# EAGLE design Addon-mapleCUx_Raspi-3V3-UART-CC2530-V03-003 (EAGLE 9.1.0)
MAPLE-CUx Large Version
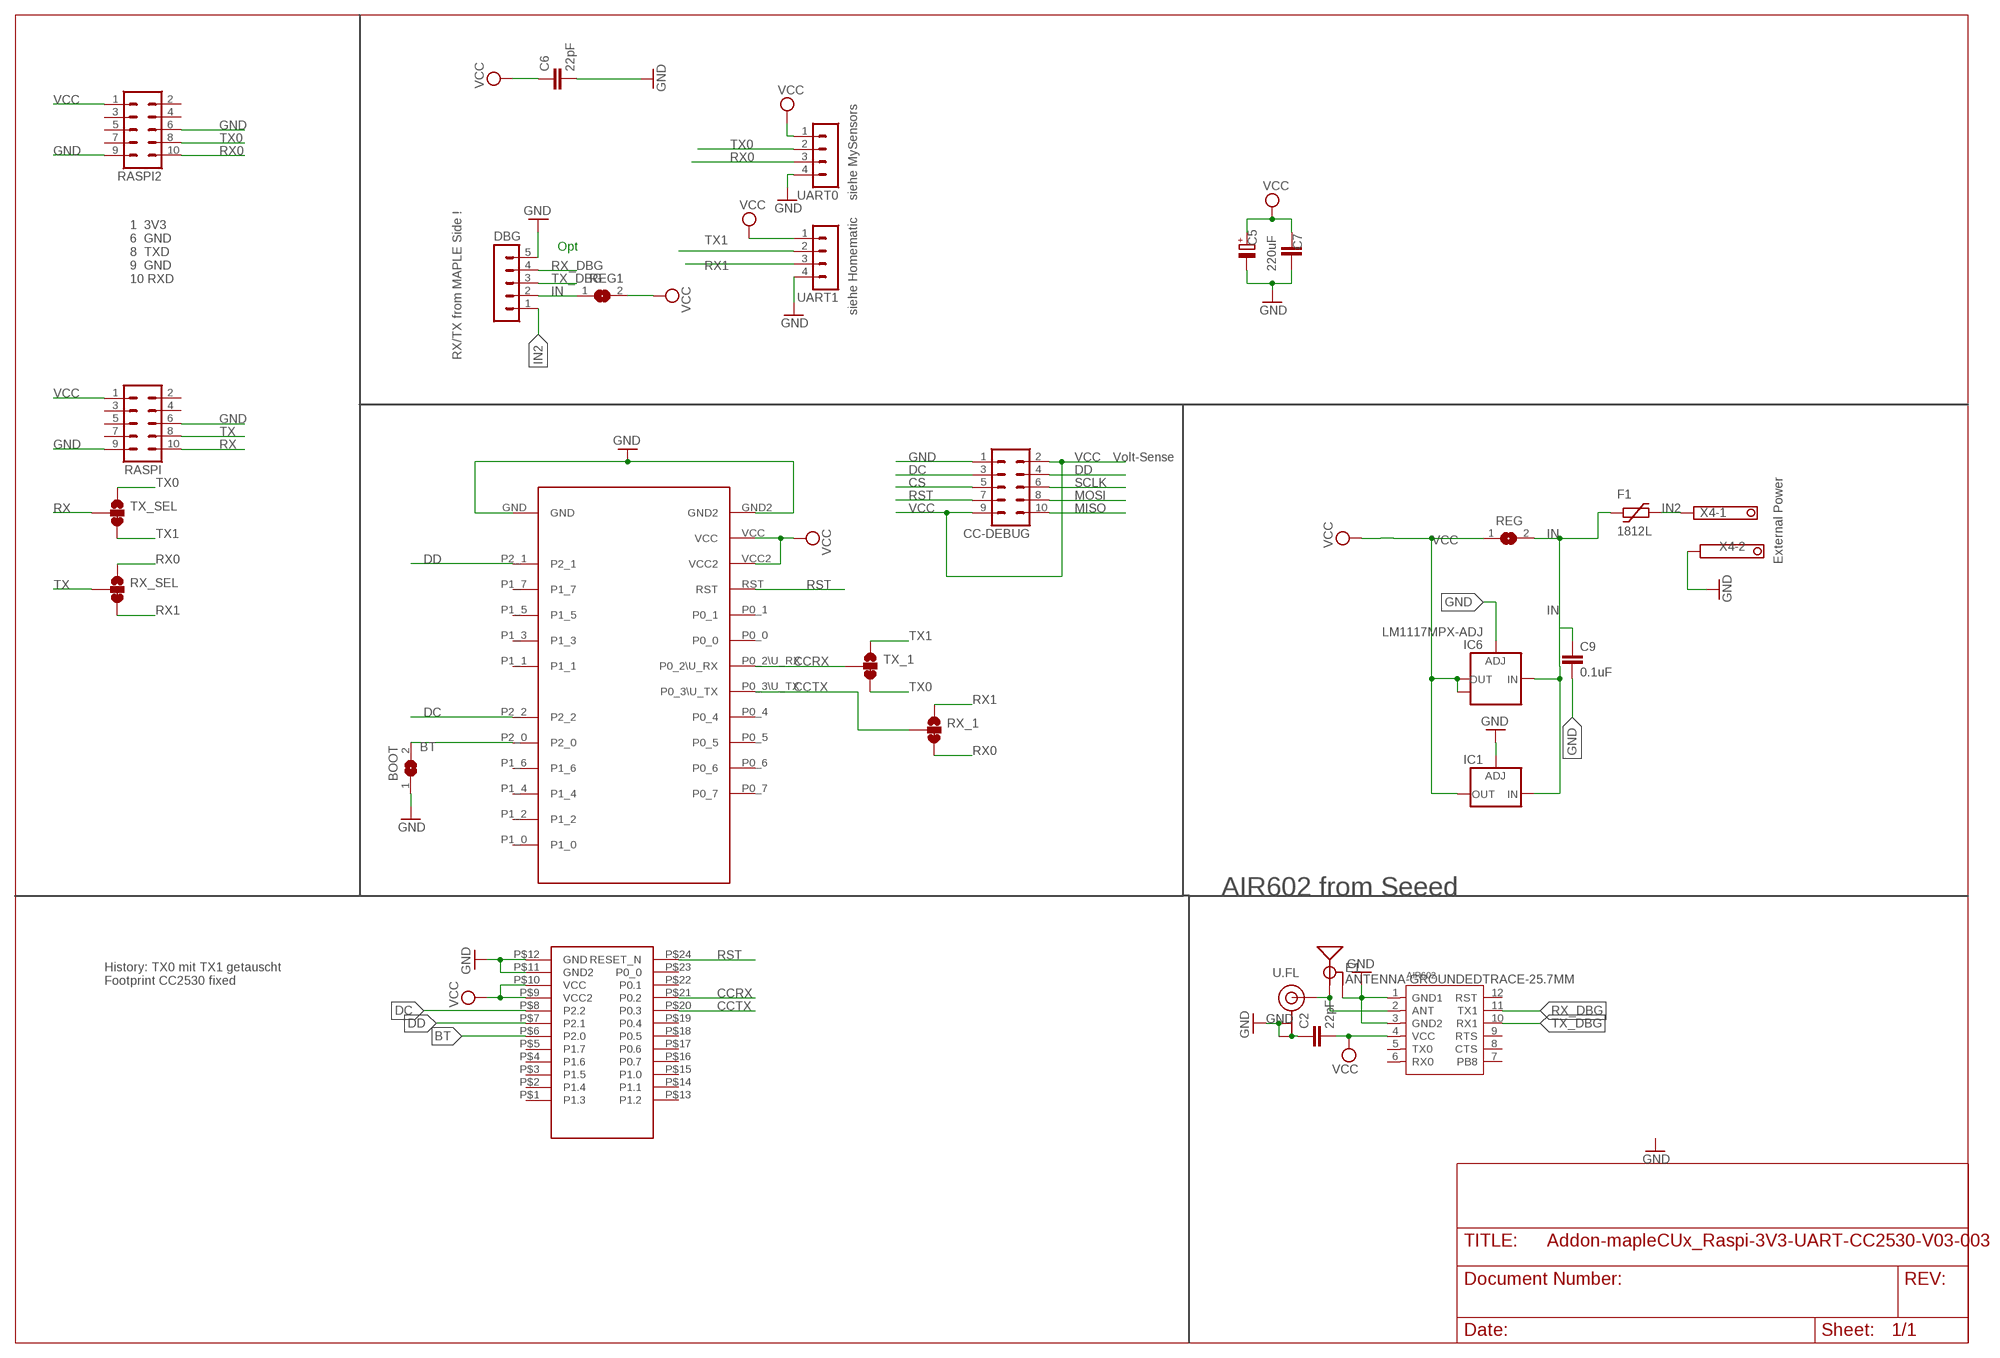
[diagram p0: schematic, sheet 1]

## Parts
AIR602  AIR602  [MODULE12P-2.0-10X12MM]
BOOT  SJ  [SJ]
C2  22pF  C-EUC0805  [C0805]
C5  220uF  CPOL-EUE5-8.5  [E5-8,5]
C6  22pF  C-EUC0805  [C0805]
C7  C-EUC1812  [C1812]
C9  0.1uF  C-EUC1206  [C1206]
CC-DEBUG  MA05-2  [MA05-2]
DBG  MA05-1  [MA05-1]
E1  ANTENNA-GROUNDEDTRACE-25.7MM  [TRACE_ANTENNA_2.4GHZ_25.7MM]
F1  1812L  [1812L]
IC1  LD117ADT50TR  [DPACK]
IC6  LM1117MPX-ADJ  [SOT223]
RASPI  MA05-2  [MA05-2]
RASPI2  MA05-2  [MA05-2]
REG  SJ  [SJ]
REG1  SJ  [SJ]
RX_1  JUMPER-SMT_3_1-NC_TRACE_SILK  [SMT-JUMPER_3_1-NC_TRACE_SILK]
RX_SEL  JUMPER-SMT_3_1-NC_TRACE_SILK  [SMT-JUMPER_3_1-NC_TRACE_SILK]
TX_1  JUMPER-SMT_3_1-NC_TRACE_SILK  [SMT-JUMPER_3_1-NC_TRACE_SILK]
TX_SEL  JUMPER-SMT_3_1-NC_TRACE_SILK  [SMT-JUMPER_3_1-NC_TRACE_SILK]
U$1  CC2530CC2530PA  [CC2530PA]
U$3  CC2530_MODULE  [CC2530_DIL]
U.FL  U.FL  [U.FL]
UART0  MA04-1  [MA04-1]
UART1  MA04-1  [MA04-1]
X4  1751248  [1751248]

## Nets
BT: BOOT.2 U$1.P$6(P2.0) U$3.P2_0
CCRX: TX_1.2 U$1.P$21(P0.2) U$3.P0_2\U_RX
CCTX: RX_1.2 U$1.P$20(P0.3) U$3.P0_3\U_TX
CS: CC-DEBUG.5
DC: CC-DEBUG.3 U$1.P$8(P2.2) U$3.P2_2
DD: CC-DEBUG.4 U$1.P$7(P2.1) U$3.P2_1
GND [PWR]: AIR602.1(GND1) AIR602.3(GND2) BOOT.1 C2.1 C5.- C6.2 C7.1 C9.2 CC-DEBUG.1 DBG.5 E1.GND E1.GND2(GND) IC1.1(ADJ) IC6.1(ADJ) RASPI2.6 RASPI2.9 RASPI.6 RASPI.9 U$1.P$11(GND2) U$1.P$12(GND) U$3.GND U$3.GND2 U.FL.1(GND) U.FL.2(GND) UART0.4 UART1.4 X4.2
IN [PWR]: C9.1 DBG.2 F1.P$1 IC1.3(IN) IC6.3(IN) REG1.1 REG.2
IN2 [PWR]: DBG.1 F1.P$2 X4.1
MISO: CC-DEBUG.10
MOSI: CC-DEBUG.8
N$4: AIR602.2(ANT) E1.ANT(SIGNAL) U.FL.FEED(SIGNAL)
RST: CC-DEBUG.7 U$1.P$24(RESET_N) U$3.RST
RX: RASPI.10 TX_SEL.2
RX0: RASPI2.10 RX_1.3 RX_SEL.1 UART0.3
RX1: RX_1.1 RX_SEL.3 UART1.3
RX_DBG: AIR602.11(TX1) DBG.4
SCLK: CC-DEBUG.6
TX: RASPI.8 RX_SEL.2
TX0: RASPI2.8 TX_1.3 TX_SEL.1 UART0.2
TX1: TX_1.1 TX_SEL.3 UART1.2
TX_DBG: AIR602.10(RX1) DBG.3
VCC [PWR]: AIR602.4(VCC) C2.2 C5.+ C6.1 C7.2 CC-DEBUG.2 CC-DEBUG.9 IC1.4(OUT) IC6.2(OUT) IC6.TAB(OUT1) RASPI2.1 RASPI.1 REG1.2 REG.1 U$1.P$9(VCC2) U$1.P$10(VCC) U$3.VCC U$3.VCC2 UART0.1 UART1.1
Unconnected: AIR602.5(TX0) AIR602.6(RX0) AIR602.7(PB8) AIR602.8(CTS) AIR602.9(RTS) AIR602.12(RST) RASPI2.2 RASPI2.3 RASPI2.4 RASPI2.5 RASPI2.7 RASPI.2 RASPI.3 RASPI.4 RASPI.5 RASPI.7 U$1.P$1(P1.3) U$1.P$2(P1.4) U$1.P$3(P1.5) U$1.P$4(P1.6) U$1.P$5(P1.7) U$1.P$13(P1.2) U$1.P$14(P1.1) U$1.P$15(P1.0) U$1.P$16(P0.7) U$1.P$17(P0.6) U$1.P$18(P0.5) U$1.P$19(P0.4) U$1.P$22(P0.1) U$1.P$23(P0_0) U$3.P0_0 U$3.P0_1 U$3.P0_4 U$3.P0_5 U$3.P0_6 U$3.P0_7 U$3.P1_0 U$3.P1_1 U$3.P1_2 U$3.P1_3 U$3.P1_4 U$3.P1_5 U$3.P1_6 U$3.P1_7

## Notes on the sheet
- siehe MySensors
- Opt
- 1  3V3
  6  GND
  8  TXD
  9  GND
  10 RXD
- siehe Homematic
- RX/TX from MAPLE Side !
- Volt-Sense
- External Power
- AIR602 from Seeed
- History: TX0 mit TX1 getauscht
  Footprint CC2530 fixed

## Library data of the parts
AIR602 = AIR602:AIR602
BOOT REG REG1 = jumper:SJ: SMD solder JUMPER
C2 = rcl:C-EU: CAPACITOR, European symbol
C5 = rcl:CPOL-EU: POLARIZED CAPACITOR, European symbol; SPICEPREFIX: C
C6 C7 C9 = rcl:C-EU: CAPACITOR, European symbol; SPICEPREFIX: C
CC-DEBUG RASPI RASPI2 = con-lstb:MA05-2: PIN HEADER; OC_FARNELL: unknown; OC_NEWARK: unknown
DBG = con-lstb:MA05-1: PIN HEADER; OC_FARNELL: unknown; OC_NEWARK: unknown
E1 = SparkFun-RF:ANTENNA-GROUNDED: Antenna w/ Ground Connection 2.4GHz antennae with signal and ground terminals. TRACE_ANTENNA_2.4GHZ_15.2MM - Meander Trace antenna 15.2 x 5.7mm footprint Based on layout from TI app note AN043 <http://www.ti.com/lit/an/swra117d/swra117d.pdf>. TRACE_ANTENNA_2.4GHZ_25.7MM - Inverted F trace antenna 25.7 x 7.5 mm footprint. Based on layout from TI design note DN0007 <http://www.ti.com/lit/an/swru120b/swru120b.pdf>.
F1 = ptc-littlefuse:1812L
IC1 = v-reg:LD117A?*: Low drop fixed and adjustable positive voltage regulators 1 A Source: http://www.st.com/stonline/products/literature/ds/7194/ld1117axx.pdf
IC6 = lm1117:LM1117MPX-ADJ
RX_1 RX_SEL TX_1 TX_SEL = SparkFun-Jumpers:JUMPER-SMT_3_1-NC_TRACE: Normally closed trace jumper (1 of 2 connections) This jumper has a trace between two pads so it's normally closed (NC). The other connection is normally open (NO). Use a razor knife to open the connection. For best results follow the IPC guidelines for cutting traces: Cutout at least 0.063 mm (0.005 in). Remove all loose material to clean up the cut area. Seal the cut with an approved epoxy. Reapply solder to reclose the connection, or to close the NO connection.
U$1 = zigbee:CC2530: CC2530 Wireless Zigbee Module 3.0-3.6V 2.405-2.485GHz
U$3 = Martin-Communication-V4:CC2530_MODULE
U.FL = SparkFun-Connectors:U.FL: SMD Antenna Connector - U.FL 2mm height, 3.0mm x 3.0mm receptacle size. SparkFun Products: SparkFun WiFi Shield - ESP8266 <https://www.sparkfun.com/products/13287> SparkFun ESP8266 Thing <https://www.sparkfun.com/products/13231> SparkFun MiniGen - Pro Mini Signal Generator Shield <https://www.sparkfun.com/products/11420>; PROD_ID: CONN-09193; SF_ID: WRL-09144
UART0 UART1 = con-lstb:MA04-1: PIN HEADER; OC_FARNELL: unknown; OC_NEWARK: unknown
X4 = con-phoenix-350:1751248: MKDS 1/ 2-3,5 Printklemme Nennstrom: 10 A Bemessungsspannung: 160 V Raster: 3,5 mm Polzahl: 2 Montageart: Löten Anschlussart: Schraubanschluss Anschlussrichtung vom Leiter zur Platine: 0° Source: http://eshop.phoenixcontact.com .. 1751248.pdf; OC_FARNELL: unknown; OC_NEWARK: unknown

## Net classes
0 default: width 0.305 mm
1 PWR: width 0.61 mm

## Board
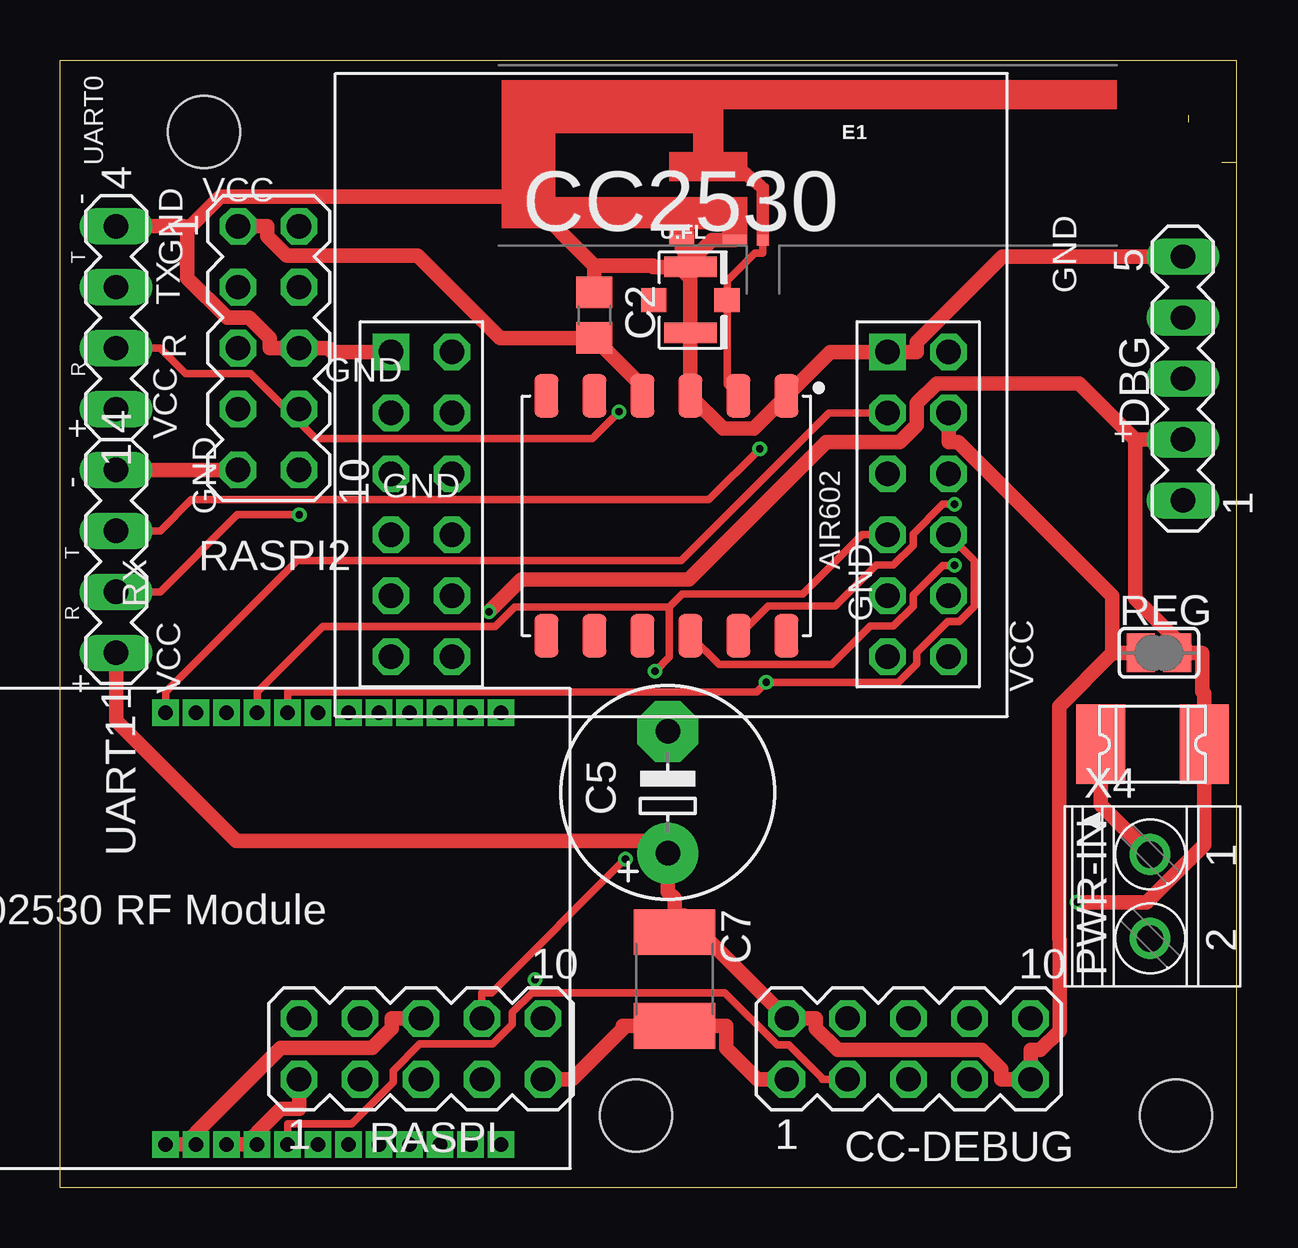
[diagram p1: board, top side]
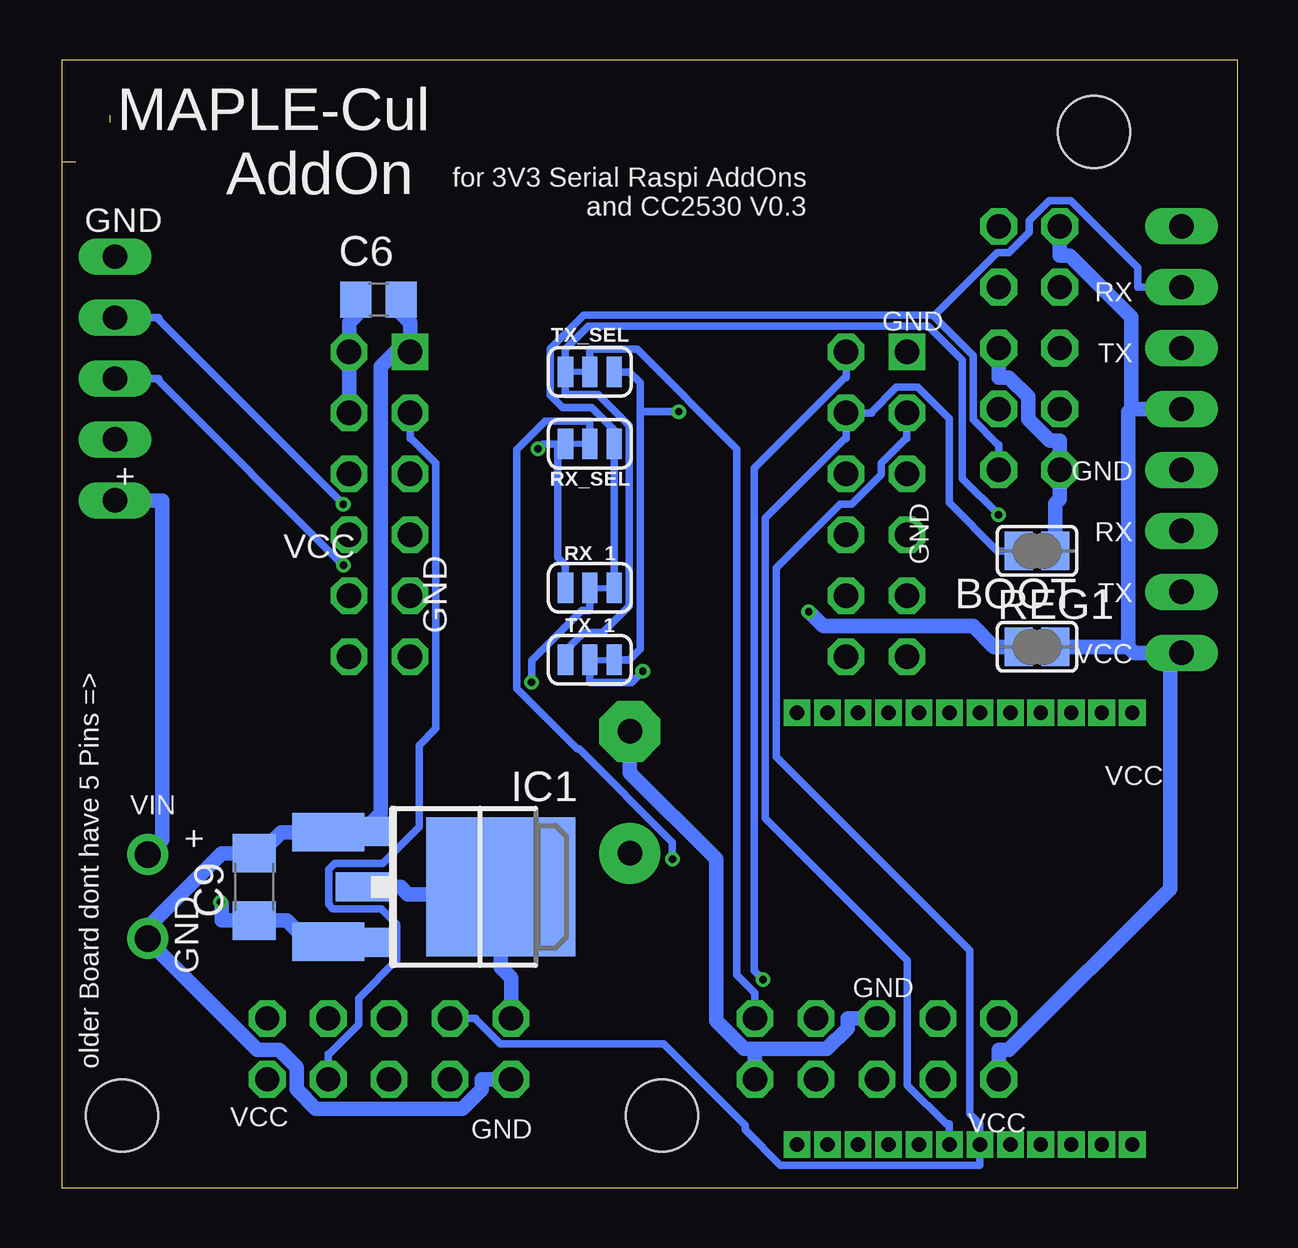
[diagram p2: board, bottom side, seen from below]

Size 49 x 47 mm. Coordinates in mm from the lower left corner, seen from the top.
Outline: 49,47 49,46.24
Outline: 47,44.7 47,44.41
Outline: 48.41,42.75 49,42.75
Outline: 49,47 0,47 0,0 49,0 49,42.75
Outline: 49,47 49,42.75
Copper layers (1*16): Top 0.035mm / dielectric 1.5mm / Bottom 0.035mm
Design rules "SeeedStudio_2layer_DRU_no_angle_20140221": minimum track width 6mil, minimum drill 12mil, track to track 6mil, track to pad 6mil, pad to pad 6mil, via to via 6mil, smd to smd 0mil, copper to edge 10mil, drill to drill 10mil, minimum pad ring 10mil, minimum via ring 6mil, stop-mask expansion 2mil, vias tented up to drill 100mil, thermal gap 10mil
Holes 3 mm at 6,44 24,3 46.5,3
tRestrict: area 0.4,2 to 1.1,47.1
bRestrict: area 0.4,0.7 to 1.1,46.4

### Footprints (pad centres in the part's own frame; a part is rotated, then mirrored left to right if it is on the bottom)
MODULE12P-2.0-10X12MM = smd 1.8 x 1: 1 -5,5; 2 -5,3; 3 -5,1; 4 -5,-1; 5 -5,-3; 6 -5,-5; 7 5,-5; 8 5,-3; 9 5,-1; 10 5,1; 11 5,3; 12 5,5
SJ = smd 1.168 x 1.6: 1 -0.762,0; 2 0.762,0
C0805 = smd 1.3 x 1.5: 1 -0.95,0; 2 0.95,0
E5-8,5 = drill 1.016 pad 2.54: + -2.54,0 | drill 1.016 pad 2.54 octagon: - 2.54,0
C1812 = smd 1.9 x 3.4: 1 -1.95,0; 2 1.95,0
C1206 = smd 1.6 x 1.8: 1 -1.4,0; 2 1.4,0
MA05-2 = drill 1.016 octagon: 1 -5.08,-1.27; 2 -5.08,1.27; 3 -2.54,-1.27; 4 -2.54,1.27; 5 0,-1.27; 6 0,1.27; 7 2.54,-1.27; 8 2.54,1.27; 9 5.08,-1.27; 10 5.08,1.27
MA05-1 = drill 1.016 long: 1 -5.08,0; 2 -2.54,0; 3 0,0; 4 2.54,0; 5 5.08,0
TRACE_ANTENNA_2.4GHZ_25.7MM = smd 0.46 x 0.46: ANT 0,0.23 | smd 1 x 0.46: GND -1.18,0.23; GND2 -3.38,0.23
1812L = smd 2.03 x 3.3: P$1 -2.16,0; P$2 2.16,0
DPACK = smd 1.6 x 3: 1 -2.28,-4.8; 3 2.28,-4.8 | smd 5.8 x 6.2: 4 0,2.38
SOT223 = smd 1.219 x 2.235: 1 -2.311,-3.099; 2 0,-3.099; 3 2.311,-3.099 | smd 3.6 x 2.2: TAB 0,3.099
SMT-JUMPER_3_1-NC_TRACE_SILK = smd 0.635 x 1.27: 1 -1.016,0; 2 0,0; 3 1.016,0
CC2530PA = drill 0.6 pad 0.813 square: P$1 -9,-17.1; P$2 -9,-15.83; P$3 -9,-14.56; P$4 -9,-13.29; P$5 -9,-12.02; P$6 -9,-10.75; P$7 -9,-9.48; P$8 -9,-8.21; P$9 -9,-6.94; P$10 -9,-5.67; P$11 -9,-4.4; P$12 -9,-3.13; P$13 9,-17.1; P$14 9,-15.83; P$15 9,-14.56; P$16 9,-13.29; P$17 9,-12.02; P$18 9,-10.75; P$19 9,-9.48; P$20 9,-8.21; P$21 9,-6.94; P$22 9,-5.67; P$23 9,-4.4; P$24 9,-3.13
CC2530_DIL = drill 1.016 square: GND 2.316,15.19; GND2 23.017,15.19 | drill 1.016 octagon: P0_0 23.017,10.11; P0_1 25.557,10.11; P0_2\U_RX 23.017,7.57; P0_3\U_TX 25.557,7.57; P0_4 23.017,5.03; P0_5 25.557,5.03; P0_6 23.017,2.49; P0_7 25.557,2.49; P1_0 4.856,2.49; P1_1 2.316,2.49; P1_2 4.856,5.03; P1_3 2.316,5.03; P1_4 4.856,7.57; P1_5 2.316,7.57; P1_6 4.856,10.11; P1_7 2.316,10.11; P2_0 4.856,12.65; P2_1 2.316,12.65; P2_2 4.856,15.19; RST 23.017,12.65; VCC 25.557,15.19; VCC2 25.557,12.65
U.FL = smd 2.2 x 0.85: 1 0,1.375; 2 0,-1.375 | smd 1.05 x 1: FEED 1.525,0; NC -1.525,0
MA04-1 = drill 1.016 long: 1 -3.81,0; 2 -1.27,0; 3 1.27,0; 4 3.81,0
1751248 = drill 1.1 pad 1.7: 1 -1.75,-0.1; 2 1.75,-0.1

### Placement (x,y rotation side)
AIR602  25.27,28 270 top
BOOT  8.37,26.54 180 bottom
C2  22.27,36.37 270 top
C5  25.33,16.47 90 top
C6  35.8,37.01 0 bottom
C7  25.61,8.69 90 top
C9  40.98,12.53 90 bottom
CC-DEBUG  35.36,5.78 0 top
DBG  46.79,33.72 90 top
E1  29.29,39.25 0 top
F1  45.52,18.48 180 top
IC1  33.09,12.53 270 bottom
IC6  33.36,12.53 270 bottom
RASPI  15.04,5.78 0 top
RASPI2  8.69,34.99 270 top
REG  45.79,22.29 0 top
REG1  8.37,22.54 0 bottom
RX_1  27,25 0 bottom
RX_SEL  27,31 180 bottom
TX_1  27,22 0 bottom
TX_SEL  27,34 180 bottom
U$1  1.27,10.79 90 top
U$3  11.47,19.64 0 top
U.FL  26.27,37 0 top
UART0  2.34,36.26 90 top
UART1  2.34,26.1 90 top
X4  45.52,12.13 270 top

### Tracks (layer width: path | path; a pad name or v marks a point on that pad's centre or on a via)
BT
  Bottom 0.305: U$1.P$6 12.02,2.65 12.16,2.65 13.77,4.27 13.77,9.47 19.69,15.39 19.69,27.91 16.37,31.22 16.33,31.22 U$3.P2_0 15.79,32.29 15.26,32.29 15.26,32.33 14.23,33.36 13.34,33.36 12.03,32.05 12.03,28.56 10.02,26.54 BOOT.2
CCRX  (via drill 0.3 pad 0.61)
  Top 0.305: 25.39,24.19 25.37,24.21 18.94,24.21 18.13,23.39 10.95,23.39 8.21,20.65 U$1.P$21 | 25.39,24.19 25.39,22.11 v24.8,21.52 | 25.39,24.19 25.92,24.73 30.94,24.73 33.42,27.21 U$3.P0_2\U_RX
  Bottom 0.305: TX_1.2 27,21.06 25.25,21.06 v24.8,21.52
CCTX  (via drill 0.3 pad 0.61)
  Top 0.305: U$1.P$20 9.48,20.65 29.02,20.65 v29.43,21.06 34.93,21.06 35.69,21.82 35.69,22.31 36.98,23.6 37.47,23.6 38.09,24.23 38.09,26.14 U$3.P0_3\U_TX
  Bottom 0.305: v29.43,21.06 29.43,21.97 27.34,24.06 27,24.06 RX_1.2
DC  (via drill 0.3 pad 0.61)
  Top 0.305: v19.79,8.67 19.79,8.12 | 19.79,8.12 27.7,8.12 29.88,5.94 30.36,5.94 31.75,4.55 31.75,4.51 CC-DEBUG.3 | 19.79,8.12 19.68,8.12 18.85,7.3 18.85,6.81 18.02,5.98 15,5.98 13.88,4.86 13.88,4.38 12.16,2.65 9.48,2.65 U$1.P$8
  Bottom 0.305: v19.79,8.67 20.14,9.03 20.14,29.99 16.37,33.76 16.33,33.76 U$3.P2_2
DD
  Bottom 0.305: U$3.P2_1 13.79,31.22 13.83,31.22 14.85,30.2 14.85,29.71 16.09,28.48 16.57,28.48 19.23,25.82 19.23,17.95 11.16,9.88 11.16,3.06 10.75,2.65 U$1.P$7 10.75,0.94 19.06,0.94 20.53,2.41 20.53,2.6 23.92,5.98 30.73,5.98 31.75,7.01 31.75,7.05 CC-DEBUG.4
GND
  Top 0.61: DBG.5 39.27,38.8 35.71,35.24 35.71,34.83 U$3.GND2 32.1,34.83 AIR602.1 28.91,31.64 27.63,31.64 AIR602.3 U.FL.2 26.27,37.91 25.81,38.38 | 26.04,39 26.66,39 27.15,39.48 E1.GND | E1.GND2 25.91,39.13 26.04,39 | 26.04,38.38 26.04,39 | 26.04,38.38 25.81,38.38 | U.FL.1 26.04,38.38 | CC-DEBUG.1 29.06,4.51 27.76,5.81 27.76,6.74 C7.1 23.45,6.74 23.45,6.62 21.34,4.51 RASPI.9 | RASPI.6 13.82,7.05 13.82,6.64 13.01,5.83 9.2,5.83 5.67,2.3 | 5.31,39.92 5.31,37.91 6.96,36.26 7.88,36.26 8.74,35.4 8.74,34.99 RASPI2.6 11.18,34.99 11.34,34.83 U$3.GND | 5.31,39.92 5.17,40.07 3.33,40.07 UART0.4 | 5.31,39.92 6.68,41.29 19.4,41.29 22.27,38.42 | U$1.P$12 5.41,1.79 5.41,2.04 5.67,2.3 | U$1.P$11 5.67,2.3 | 22.27,38.42 24.71,38.42 24.71,38.38 25.81,38.38 | C2.1 22.27,38.42 | UART1.4 RASPI2.9
  Bottom 0.61: 20.12,5.78 17.12,5.78 16.26,6.64 16.26,7.05 RASPI.6 | 20.12,5.78 20.57,5.78 21.74,6.95 21.74,13.7 25.33,17.29 C5.- | 20.12,5.78 20.12,5.73 RASPI.9 | RASPI2.6 9.96,33.77 9.55,33.77 8.74,32.96 8.74,32.04 7.83,31.13 7.42,31.13 RASPI2.9 7.42,28.69 7.6,28.51 BOOT.1 | CC-DEBUG.1 31.5,4.51 31.5,4.1 32.31,3.29 38.41,3.29 39.22,4.1 39.22,5.02 39.94,5.73 40.85,5.73 45.42,10.3 X4.2 45.42,10.85 42.34,13.93 C9.2 40.73,13.93 39.85,14.81 IC1.1 37.86,14.84 IC6.1 35.71,15.59 35.71,34.22 34.49,35.44 | 34.49,35.44 34.49,36.05 34.85,36.42 C6.2 | U$3.GND2 34.49,35.44
IN  (via drill 0.3 pad 0.61)
  Top 0.61: 47.08,22.29 44.81,24.56 44.81,31.18 | 47.08,22.29 47.59,22.29 47.59,20.67 47.68,20.59 F1.P$1 47.68,14.29 45.28,11.89 v42.39,11.89 | REG.2 47.08,22.29 | DBG.2 44.81,31.18 | v17.88,24 19.21,25.34 26.2,25.34 31.94,31.07 34.99,31.07 35.71,31.78 35.71,32.69 36.53,33.51 42.48,33.51 44.81,31.18
  Bottom 0.61: REG1.1 10.17,22.54 11.03,23.4 17.28,23.4 v17.88,24 | v42.39,11.89 42.34,11.84 42.34,11.13 C9.1 39.62,11.13 38.74,10.25 IC1.3 37.86,10.22 IC6.3
IN2
  Top 0.61: X4.1 43.36,15.94 F1.P$2
  Bottom 0.61: DBG.1 44.81,28.64 44.81,14.49 X4.1
N$4
  Top 0.305: E1.ANT 29.29,38.95 28.94,38.95 27.8,37.8 U.FL.FEED 27.8,33.48 AIR602.2
RST
  Top 0.305: U$1.P$24 4.4,20.65 9.89,26.14 25.88,26.14 32.03,32.29 U$3.RST
  Bottom 0.305: CC-DEBUG.7 37.9,5.58 37.86,5.58 36.63,6.8 36.63,7.89 35.04,9.48 35.04,10.96 35.69,11.62 37.7,11.62 37.88,11.8 37.88,13.26 37.63,13.52 35.62,13.52 34.12,15.02 34.12,18.43 33.42,19.13 33.42,30.2 34.45,31.22 34.49,31.22 U$3.RST
RX
  Bottom 0.305: RASPI.10 20.12,8.12 20.87,8.87 20.87,30.78 25.03,34.94 27,34.94 TX_SEL.2
RX0
  Bottom 0.305: 12.68,36.32 11.03,34.67 11.03,32 10,30.98 9.96,30.98 RASPI2.10 | 12.68,36.32 12.71,36.36 27.24,36.36 28.64,34.96 28.64,33.03 28.12,32.52 26.93,32.52 25.98,31.57 RX_SEL.1 RX_1.3 | 12.68,36.32 10.03,38.97 9.54,38.97 8.69,39.83 8.69,40.31 7.86,41.14 6.97,41.14 4.17,38.34 4.17,37.53 UART0.3
RX1  (via drill 0.3 pad 0.61)
  Top 0.305: v29.16,30.79 27.04,28.67 5.47,28.67 4.17,27.37 UART1.3
  Bottom 0.305: RX_1.1 28.02,25.94 28.33,26.25 28.33,31 | 28.33,31 28.64,31 28.95,31 v29.16,30.79 | RX_SEL.3 28.33,31
RX_DBG  (via drill 0.3 pad 0.61)
  Top 0.305: AIR602.11 29.51,24.24 32.31,24.24 34.01,25.94 34.73,25.94 35.55,26.77 35.55,27.25 36.78,28.48 v37.27,28.48
  Bottom 0.305: v37.27,28.48 44.96,36.17 44.96,36.26 DBG.4
TX  (via drill 0.3 pad 0.61)
  Top 0.305: RASPI.8 17.58,8.12 17.98,8.12 v23.56,13.69
  Bottom 0.305: RX_SEL.2 27,31.94 28.87,31.94 30.04,30.77 30.04,20.8 27.52,18.28 27.45,18.28 23.56,14.39 v23.56,13.69
TX0  (via drill 0.3 pad 0.61)
  Top 0.305: UART0.2 4.17,34.99 5.24,33.92 7.95,33.92 9.43,32.45 | 9.43,32.45 10.65,31.22 22.18,31.22 v23.3,32.34 | RASPI2.8 9.43,32.45
  Bottom 0.305: 24.9,32.34 24.9,22.46 25.36,22 TX_1.3 | 24.9,32.34 24.9,33.54 25.36,34 TX_SEL.1 | 24.9,32.34 v23.3,32.34
TX1  (via drill 0.3 pad 0.61)
  Top 0.305: UART1.2 4.17,24.83 7.38,28.04 v9.97,28.04
  Bottom 0.305: v9.97,28.04 11.49,29.56 11.49,34.48 12.9,35.9 27.06,35.9 28.02,34.94 TX_SEL.3 28.02,33.06 26.65,33.06 25.36,31.77 25.36,24.24 26.47,23.13 27.25,23.13 28.02,22.37 TX_1.1
TX_DBG  (via drill 0.3 pad 0.61)
  Top 0.305: AIR602.10 27.48,21.79 32.15,21.79 33.76,23.4 34.73,23.4 35.55,24.23 35.55,24.71 36.78,25.93 v37.27,25.93
  Bottom 0.305: v37.27,25.93 44.96,33.63 44.96,33.72 DBG.3
VCC
  Top 0.61: 43.85,22.29 41.62,20.06 41.62,10.37 41.66,10.33 41.66,6.54 40.85,5.73 40.44,5.73 CC-DEBUG.9 39.22,4.51 39.22,4.92 38.41,5.73 32.41,5.73 31.5,6.64 31.5,7.05 CC-DEBUG.2 25.99,11.34 25.61,11.34 | 43.85,22.29 44.51,22.29 REG.1 | 43.85,22.29 43.85,24.65 37.44,31.07 37.03,31.07 U$3.VCC2 | UART1.1 2.34,19.45 7.34,14.45 24.81,14.45 C5.+ 25.33,12.32 25.61,12.05 25.61,11.34 | C7.2 25.61,11.34 | RASPI.1 9.96,3.29 9.2,3.29 8.21,2.3 | U$1.P$10 7.95,1.79 7.95,2.04 8.21,2.3 | U$1.P$9 8.21,2.3 | AIR602.4 24.27,33.41 C2.2 18.34,35.41 14.9,38.85 9.45,38.85 8.64,39.66 8.64,40.07 RASPI2.1
  Bottom 0.61: U$3.VCC2 U$3.VCC 37.03,36.05 36.76,36.32 C6.1 | IC6.2 34.88,12.53 34.58,12.22 30.71,12.22 | 30.71,12.22 IC1.4 IC6.TAB | 30.71,12.22 30.71,12.19 30.71,9.17 30.28,8.74 CC-DEBUG.2 | 4.45,32.45 4.45,36.29 7.01,38.85 7.42,38.85 RASPI2.1 | 4.57,22.54 4.57,32.33 4.45,32.45 | 4.45,32.45 4.32,32.45 UART0.1 | 4.57,22.54 6.56,22.54 REG1.2 | 4.57,22.54 4.32,22.29 2.83,22.29 | RASPI.1 9.96,5.73 9.55,5.73 2.83,12.45 2.83,22.29 | UART1.1 2.83,22.29

### Text on the board
tNames: GND | VCC | - | T | TX | GND | R | R | GND | + | VCC | + | - | GND | GND | T | R | RX | VCC | GND | VCC | + | PWR-IN
bNames: MAPLE-Cul / AddOn | for 3V3 Serial Raspi AddOns / and CC2530 V0.3 | GND | RX | GND | TX | GND | + | RX | VCC | GND | GND | TX | VCC | VCC | VIN | + | GND | GND | older Board dont have 5 Pins => | VCC | GND | VCC